# Altium schematic sheet projet LED.SchDoc
size A2
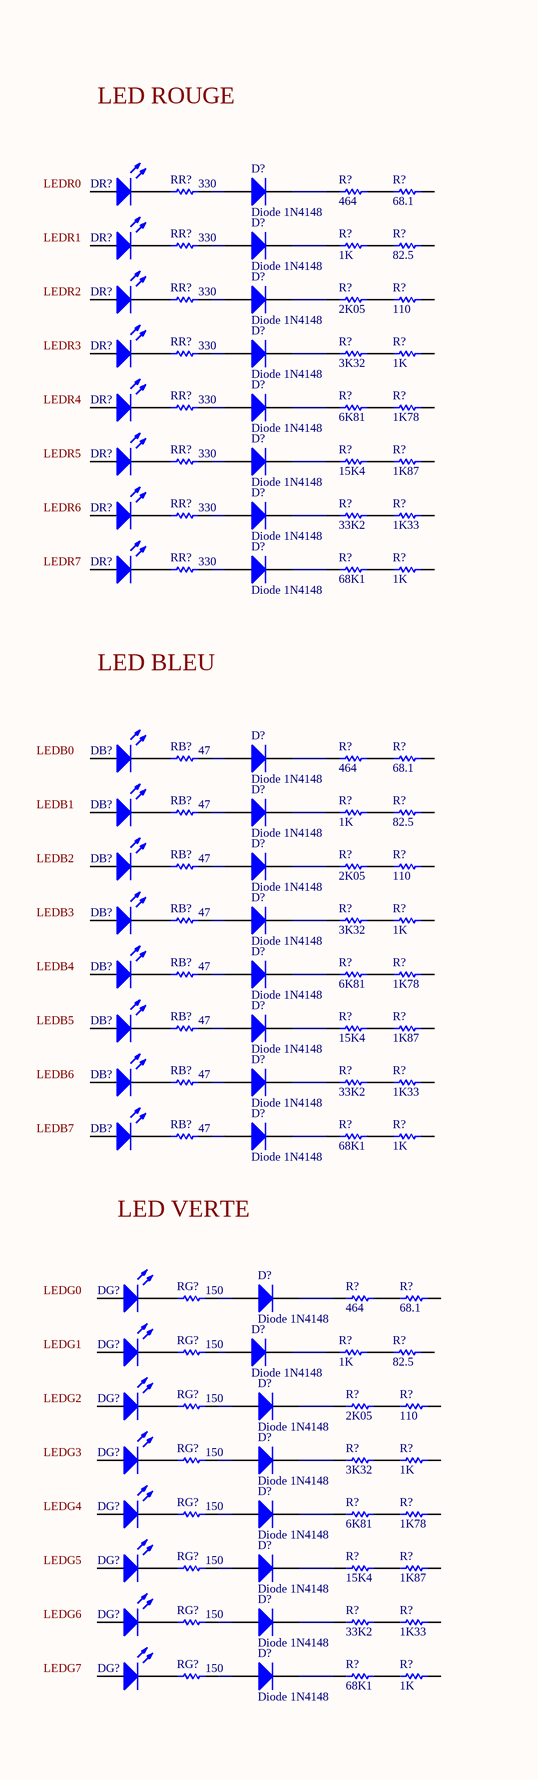
[diagram p0: projet LED.SchDoc, left]
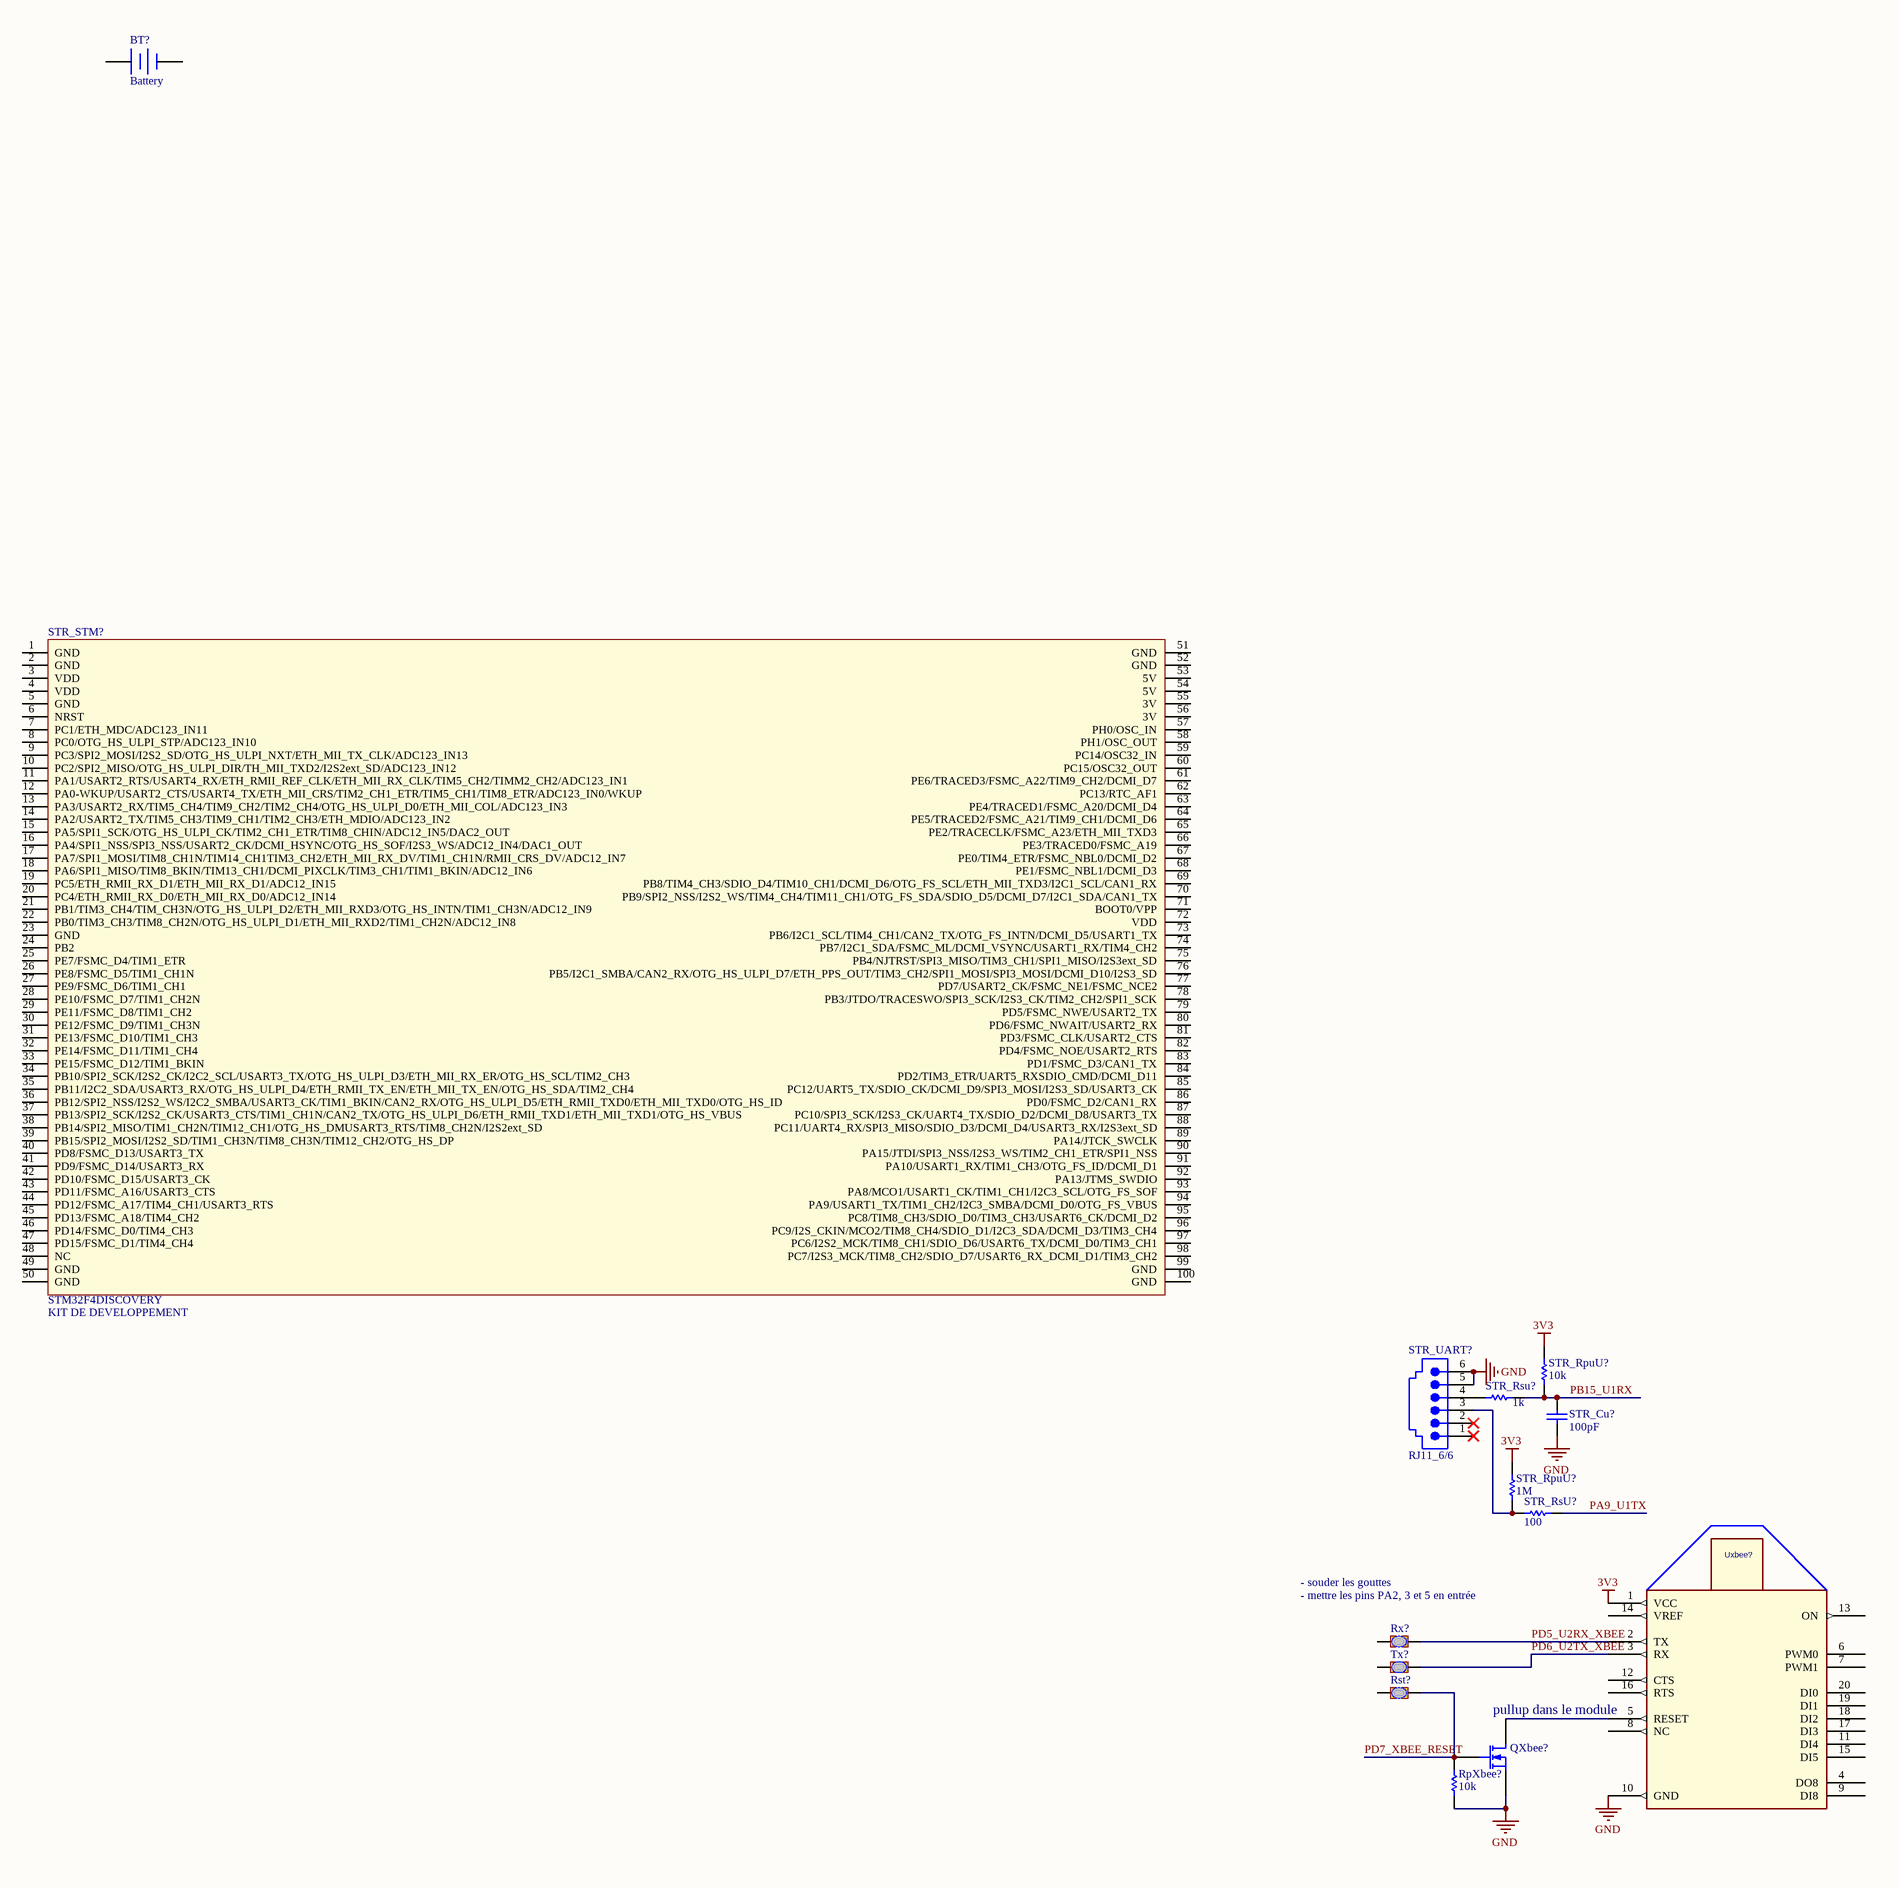
[diagram p1: projet LED.SchDoc, right]

## Parts
(Parts that share a designator on the sheet are numbered #1, #2 ... from top to bottom, then left to right.)
BT?  Battery  [BAT-2]
D?#1  Diode 1N4148  [DO-35]
D?#2  Diode 1N4148  [DO-35]
D?#3  Diode 1N4148  [DO-35]
D?#4  Diode 1N4148  [DO-35]
D?#5  Diode 1N4148  [DO-35]
D?#6  Diode 1N4148  [DO-35]
D?#7  Diode 1N4148  [DO-35]
D?#8  Diode 1N4148  [DO-35]
D?#9  Diode 1N4148  [DO-35]
D?#10  Diode 1N4148  [DO-35]
D?#11  Diode 1N4148  [DO-35]
D?#12  Diode 1N4148  [DO-35]
D?#13  Diode 1N4148  [DO-35]
D?#14  Diode 1N4148  [DO-35]
D?#15  Diode 1N4148  [DO-35]
D?#16  Diode 1N4148  [DO-35]
D?#17  Diode 1N4148  [DO-35]
D?#18  Diode 1N4148  [DO-35]
D?#19  Diode 1N4148  [DO-35]
D?#20  Diode 1N4148  [DO-35]
D?#21  Diode 1N4148  [DO-35]
D?#22  Diode 1N4148  [DO-35]
D?#23  Diode 1N4148  [DO-35]
D?#24  Diode 1N4148  [DO-35]
DB?#1  LED  [LED_sideView_1204]  (value not drawn)
DB?#2  LED  [LED_sideView_1204]  (value not drawn)
DB?#3  LED  [LED_sideView_1204]  (value not drawn)
DB?#4  LED  [LED_sideView_1204]  (value not drawn)
DB?#5  LED  [LED_sideView_1204]  (value not drawn)
DB?#6  LED  [LED_sideView_1204]  (value not drawn)
DB?#7  LED  [LED_sideView_1204]  (value not drawn)
DB?#8  LED  [LED_sideView_1204]  (value not drawn)
DG?#1  LED  [LED_sideView_1204]  (value not drawn)
DG?#2  LED  [LED_sideView_1204]  (value not drawn)
DG?#3  LED  [LED_sideView_1204]  (value not drawn)
DG?#4  LED  [LED_sideView_1204]  (value not drawn)
DG?#5  LED  [LED_sideView_1204]  (value not drawn)
DG?#6  LED  [LED_sideView_1204]  (value not drawn)
DG?#7  LED  [LED_sideView_1204]  (value not drawn)
DG?#8  LED  [LED_sideView_1204]  (value not drawn)
DR?#1  LED  [LED_sideView_1204]  (value not drawn)
DR?#2  LED  [LED_sideView_1204]  (value not drawn)
DR?#3  LED  [LED_sideView_1204]  (value not drawn)
DR?#4  LED  [LED_sideView_1204]  (value not drawn)
DR?#5  LED  [LED_sideView_1204]  (value not drawn)
DR?#6  LED  [LED_sideView_1204]  (value not drawn)
DR?#7  LED  [LED_sideView_1204]  (value not drawn)
DR?#8  LED  [LED_sideView_1204]  (value not drawn)
QXbee?  Transistor MOSFET-N  [SOT23-3N]  (value not drawn)
R?#1  464  [R0805_N]
R?#2  68.1  [R0805_N]
R?#3  1K  [R0805_N]
R?#4  82.5  [R0805_N]
R?#5  2K05  [R0805_N]
R?#6  110  [R0805_N]
R?#7  3K32  [R0805_N]
R?#8  1K  [R0805_N]
R?#9  6K81  [R0805_N]
R?#10  1K78  [R0805_N]
R?#11  15K4  [R0805_N]
R?#12  1K87  [R0805_N]
R?#13  33K2  [R0805_N]
R?#14  1K33  [R0805_N]
R?#15  68K1  [R0805_N]
R?#16  1K  [R0805_N]
R?#17  464  [R0805_N]
R?#18  68.1  [R0805_N]
R?#19  1K  [R0805_N]
R?#20  82.5  [R0805_N]
R?#21  2K05  [R0805_N]
R?#22  110  [R0805_N]
R?#23  3K32  [R0805_N]
R?#24  1K  [R0805_N]
R?#25  6K81  [R0805_N]
R?#26  1K78  [R0805_N]
R?#27  15K4  [R0805_N]
R?#28  1K87  [R0805_N]
R?#29  33K2  [R0805_N]
R?#30  1K33  [R0805_N]
R?#31  68K1  [R0805_N]
R?#32  1K  [R0805_N]
R?#33  464  [R0805_N]
R?#34  68.1  [R0805_N]
R?#35  1K  [R0805_N]
R?#36  82.5  [R0805_N]
R?#37  2K05  [R0805_N]
R?#38  110  [R0805_N]
R?#39  3K32  [R0805_N]
R?#40  1K  [R0805_N]
R?#41  6K81  [R0805_N]
R?#42  1K78  [R0805_N]
R?#43  15K4  [R0805_N]
R?#44  1K87  [R0805_N]
R?#45  33K2  [R0805_N]
R?#46  1K33  [R0805_N]
R?#47  68K1  [R0805_N]
R?#48  1K  [R0805_N]
RB?#1  47  [R1206_N]
RB?#2  47  [R1206_N]
RB?#3  47  [R1206_N]
RB?#4  47  [R1206_N]
RB?#5  47  [R1206_N]
RB?#6  47  [R1206_N]
RB?#7  47  [R1206_N]
RB?#8  47  [R1206_N]
RG?#1  150  [R1206_N]
RG?#2  150  [R1206_N]
RG?#3  150  [R1206_N]
RG?#4  150  [R1206_N]
RG?#5  150  [R1206_N]
RG?#6  150  [R1206_N]
RG?#7  150  [R1206_N]
RG?#8  150  [R1206_N]
RpXbee?  10k  [R1206_N]
RR?#1  330  [R1206_N]
RR?#2  330  [R1206_N]
RR?#3  330  [R1206_N]
RR?#4  330  [R1206_N]
RR?#5  330  [R1206_N]
RR?#6  330  [R1206_N]
RR?#7  330  [R1206_N]
RR?#8  330  [R1206_N]
Rst?  Goutte Strap_2  [Goutte Strap_2 Pads_Clearance 0.254mm]  (value not drawn)
Rx?  Goutte Strap_2  [Goutte Strap_2 Pads_Clearance 0.254mm]  (value not drawn)
STR_Cu?  100pF  [C0805_N]
STR_RpuU?#1  10k  [R1206_N]
STR_RpuU?#2  1M  [R1206_N]
STR_Rsu?#1  1k  [R1206_N]
STR_RsU?#2  100  [R1206_N]
STR_STM?  STM32F4DISCOVERY  Type: KIT DE DEVELOPPEMENT  [STM32_F4DISCOVERY]
STR_UART?  RJ11_6/6  [RJ11_6/6 - Wurth Half Shielded Tab Down WR-MJ]
Tx?  Goutte Strap_2  [Goutte Strap_2 Pads_Clearance 0.254mm]  (value not drawn)
Uxbee?  XBee  [MODULE_XBEE]  (value not drawn)

## Nets
3V3: STR_RpuU?#1.2 STR_RpuU?#2.2 Uxbee?.1(VCC)
GND: QXbee?.2(S) RpXbee?.2 STR_Cu?.1 STR_UART?.5 STR_UART?.6 Uxbee?.10(GND)
PA9_U1TX: STR_RsU?#2.2
PB15_U1RX: STR_Cu?.2 STR_RpuU?#1.1 STR_Rsu?#1.1
PD5_U2RX_XBEE: Rx?.2 Uxbee?.2(TX)
PD6_U2TX_XBEE: Tx?.2 Uxbee?.3(RX)
PD7_XBEE_RESET: QXbee?.1(G) RpXbee?.1 Rst?.2
NetD?#1_1: D?#1.1(A) RR?#1.1
NetD?#1_2: D?#1.2(K) R?#1.1
NetD?#2_1: D?#2.1(A) RR?#2.1
NetD?#2_2: D?#2.2(K) R?#3.1
NetD?#3_1: D?#3.1(A) RR?#3.1
NetD?#3_2: D?#3.2(K) R?#5.1
NetD?#4_1: D?#4.1(A) RR?#4.1
NetD?#4_2: D?#4.2(K) R?#7.1
NetD?#5_1: D?#5.1(A) RR?#5.1
NetD?#5_2: D?#5.2(K) R?#9.1
NetD?#6_1: D?#6.1(A) RR?#6.1
NetD?#6_2: D?#6.2(K) R?#11.1
NetD?#7_1: D?#7.1(A) RR?#7.1
NetD?#7_2: D?#7.2(K) R?#13.1
NetD?#8_1: D?#8.1(A) RR?#8.1
NetD?#8_2: D?#8.2(K) R?#15.1
NetD?#9_1: D?#9.1(A) RB?#1.1
NetD?#9_2: D?#9.2(K) R?#17.1
NetD?#10_1: D?#10.1(A) RB?#2.1
NetD?#10_2: D?#10.2(K) R?#19.1
NetD?#11_1: D?#11.1(A) RB?#3.1
NetD?#11_2: D?#11.2(K) R?#21.1
NetD?#12_1: D?#12.1(A) RB?#4.1
NetD?#12_2: D?#12.2(K) R?#23.1
NetD?#13_1: D?#13.1(A) RB?#5.1
NetD?#13_2: D?#13.2(K) R?#25.1
NetD?#14_1: D?#14.1(A) RB?#6.1
NetD?#14_2: D?#14.2(K) R?#27.1
NetD?#15_1: D?#15.1(A) RB?#7.1
NetD?#15_2: D?#15.2(K) R?#29.1
NetD?#16_1: D?#16.1(A) RB?#8.1
NetD?#16_2: D?#16.2(K) R?#31.1
NetD?#17_1: D?#17.1(A) RG?#1.1
NetD?#17_2: D?#17.2(K) R?#33.1
NetD?#18_1: D?#18.1(A) RG?#2.1
NetD?#18_2: D?#18.2(K) R?#35.1
NetD?#19_1: D?#19.1(A) RG?#3.1
NetD?#19_2: D?#19.2(K) R?#37.1
NetD?#20_1: D?#20.1(A) RG?#4.1
NetD?#20_2: D?#20.2(K) R?#39.1
NetD?#21_1: D?#21.1(A) RG?#5.1
NetD?#21_2: D?#21.2(K) R?#41.1
NetD?#22_1: D?#22.1(A) RG?#6.1
NetD?#22_2: D?#22.2(K) R?#43.1
NetD?#23_1: D?#23.1(A) RG?#7.1
NetD?#23_2: D?#23.2(K) R?#45.1
NetD?#24_1: D?#24.1(A) RG?#8.1
NetD?#24_2: D?#24.2(K) R?#47.1
NetDB?#1_2: DB?#1.2(K) RB?#1.2
NetDB?#2_2: DB?#2.2(K) RB?#2.2
NetDB?#3_2: DB?#3.2(K) RB?#3.2
NetDB?#4_2: DB?#4.2(K) RB?#4.2
NetDB?#5_2: DB?#5.2(K) RB?#5.2
NetDB?#6_2: DB?#6.2(K) RB?#6.2
NetDB?#7_2: DB?#7.2(K) RB?#7.2
NetDB?#8_2: DB?#8.2(K) RB?#8.2
NetDG?#1_2: DG?#1.2(K) RG?#1.2
NetDG?#2_2: DG?#2.2(K) RG?#2.2
NetDG?#3_2: DG?#3.2(K) RG?#3.2
NetDG?#4_2: DG?#4.2(K) RG?#4.2
NetDG?#5_2: DG?#5.2(K) RG?#5.2
NetDG?#6_2: DG?#6.2(K) RG?#6.2
NetDG?#7_2: DG?#7.2(K) RG?#7.2
NetDG?#8_2: DG?#8.2(K) RG?#8.2
NetDR?#1_2: DR?#1.2(K) RR?#1.2
NetDR?#2_2: DR?#2.2(K) RR?#2.2
NetDR?#3_2: DR?#3.2(K) RR?#3.2
NetDR?#4_2: DR?#4.2(K) RR?#4.2
NetDR?#5_2: DR?#5.2(K) RR?#5.2
NetDR?#6_2: DR?#6.2(K) RR?#6.2
NetDR?#7_2: DR?#7.2(K) RR?#7.2
NetDR?#8_2: DR?#8.2(K) RR?#8.2
NetQXbee?_3: QXbee?.3(D) Uxbee?.5(RESET)
NetR?#1_2: R?#1.2 R?#2.1
NetR?#3_2: R?#3.2 R?#4.1
NetR?#5_2: R?#5.2 R?#6.1
NetR?#7_2: R?#7.2 R?#8.1
NetR?#9_2: R?#9.2 R?#10.1
NetR?#11_2: R?#11.2 R?#12.1
NetR?#13_2: R?#13.2 R?#14.1
NetR?#15_2: R?#15.2 R?#16.1
NetR?#17_2: R?#17.2 R?#18.1
NetR?#19_2: R?#19.2 R?#20.1
NetR?#21_2: R?#21.2 R?#22.1
NetR?#23_2: R?#23.2 R?#24.1
NetR?#25_2: R?#25.2 R?#26.1
NetR?#27_2: R?#27.2 R?#28.1
NetR?#29_2: R?#29.2 R?#30.1
NetR?#31_2: R?#31.2 R?#32.1
NetR?#33_2: R?#33.2 R?#34.1
NetR?#35_2: R?#35.2 R?#36.1
NetR?#37_2: R?#37.2 R?#38.1
NetR?#39_2: R?#39.2 R?#40.1
NetR?#41_2: R?#41.2 R?#42.1
NetR?#43_2: R?#43.2 R?#44.1
NetR?#45_2: R?#45.2 R?#46.1
NetR?#47_2: R?#47.2 R?#48.1
NetSTR_RpuU?#2_1: STR_RpuU?#2.1 STR_RsU?#2.1 STR_UART?.3
NetSTR_Rsu?#1_2: STR_Rsu?#1.2 STR_UART?.4

Not connected (* = marked no-connect by the designer): BT? 1(+) 2(-); DB?#1 1(A); DB?#2 1(A); DB?#3 1(A); DB?#4 1(A); DB?#5 1(A); DB?#6 1(A); DB?#7 1(A); DB?#8 1(A); DG?#1 1(A); DG?#2 1(A); DG?#3 1(A); DG?#4 1(A); DG?#5 1(A); DG?#6 1(A); DG?#7 1(A); DG?#8 1(A); DR?#1 1(A); DR?#2 1(A); DR?#3 1(A); DR?#4 1(A); DR?#5 1(A); DR?#6 1(A); DR?#7 1(A); DR?#8 1(A); R?#2 2; R?#4 2; R?#6 2; R?#8 2; R?#10 2; R?#12 2; R?#14 2; R?#16 2; R?#18 2; R?#20 2; R?#22 2; R?#24 2; R?#26 2; R?#28 2; R?#30 2; R?#32 2; R?#34 2; R?#36 2; R?#38 2; R?#40 2; R?#42 2; R?#44 2; R?#46 2; R?#48 2; Rst? 1; Rx? 1; STR_STM? 1(GND) 2(GND) 3(VDD) 4(VDD) 5(GND) 6(NRST) 7(PC1/ETH_MDC/ADC123_IN11) 8(PC0/OTG_HS_ULPI_STP/ADC123_IN10) 9(PC3/SPI2_MOSI/I2S2_SD/OTG_HS_ULPI_NXT/ETH_MII_TX_CLK/ADC123_IN13) 10(PC2/SPI2_MISO/OTG_HS_ULPI_DIR/TH_MII_TXD2/I2S2ext_SD/ADC123_IN12) 11(PA1/USART2_RTS/USART4_RX/ETH_RMII_REF_CLK/ETH_MII_RX_CLK/TIM5_CH2/TIMM2_CH2/ADC123_IN1) 12(PA0-WKUP/USART2_CTS/USART4_TX/ETH_MII_CRS/TIM2_CH1_ETR/TIM5_CH1/TIM8_ETR/ADC123_IN0/WKUP) 13(PA3/USART2_RX/TIM5_CH4/TIM9_CH2/TIM2_CH4/OTG_HS_ULPI_D0/ETH_MII_COL/ADC123_IN3) 14(PA2/USART2_TX/TIM5_CH3/TIM9_CH1/TIM2_CH3/ETH_MDIO/ADC123_IN2) 15(PA5/SPI1_SCK/OTG_HS_ULPI_CK/TIM2_CH1_ETR/TIM8_CHIN/ADC12_IN5/DAC2_OUT) 16(PA4/SPI1_NSS/SPI3_NSS/USART2_CK/DCMI_HSYNC/OTG_HS_SOF/I2S3_WS/ADC12_IN4/DAC1_OUT) 17(PA7/SPI1_MOSI/TIM8_CH1N/TIM14_CH1TIM3_CH2/ETH_MII_RX_DV/TIM1_CH1N/RMII_CRS_DV/ADC12_IN7) 18(PA6/SPI1_MISO/TIM8_BKIN/TIM13_CH1/DCMI_PIXCLK/TIM3_CH1/TIM1_BKIN/ADC12_IN6) 19(PC5/ETH_RMII_RX_D1/ETH_MII_RX_D1/ADC12_IN15) 20(PC4/ETH_RMII_RX_D0/ETH_MII_RX_D0/ADC12_IN14) 21(PB1/TIM3_CH4/TIM_CH3N/OTG_HS_ULPI_D2/ETH_MII_RXD3/OTG_HS_INTN/TIM1_CH3N/ADC12_IN9) 22(PB0/TIM3_CH3/TIM8_CH2N/OTG_HS_ULPI_D1/ETH_MII_RXD2/TIM1_CH2N/ADC12_IN8) 23(GND) 24(PB2) 25(PE7/FSMC_D4/TIM1_ETR) 26(PE8/FSMC_D5/TIM1_CH1N) 27(PE9/FSMC_D6/TIM1_CH1) 28(PE10/FSMC_D7/TIM1_CH2N) 29(PE11/FSMC_D8/TIM1_CH2) 30(PE12/FSMC_D9/TIM1_CH3N) 31(PE13/FSMC_D10/TIM1_CH3) 32(PE14/FSMC_D11/TIM1_CH4) 33(PE15/FSMC_D12/TIM1_BKIN) 34(PB10/SPI2_SCK/I2S2_CK/I2C2_SCL/USART3_TX/OTG_HS_ULPI_D3/ETH_MII_RX_ER/OTG_HS_SCL/TIM2_CH3) 35(PB11/I2C2_SDA/USART3_RX/OTG_HS_ULPI_D4/ETH_RMII_TX_EN/ETH_MII_TX_EN/OTG_HS_SDA/TIM2_CH4) 36(PB12/SPI2_NSS/I2S2_WS/I2C2_SMBA/USART3_CK/TIM1_BKIN/CAN2_RX/OTG_HS_ULPI_D5/ETH_RMII_TXD0/ETH_MII_TXD0/OTG_HS_ID) 37(PB13/SPI2_SCK/I2S2_CK/USART3_CTS/TIM1_CH1N/CAN2_TX/OTG_HS_ULPI_D6/ETH_RMII_TXD1/ETH_MII_TXD1/OTG_HS_VBUS) 38(PB14/SPI2_MISO/TIM1_CH2N/TIM12_CH1/OTG_HS_DMUSART3_RTS/TIM8_CH2N/I2S2ext_SD) 39(PB15/SPI2_MOSI/I2S2_SD/TIM1_CH3N/TIM8_CH3N/TIM12_CH2/OTG_HS_DP) 40(PD8/FSMC_D13/USART3_TX) 41(PD9/FSMC_D14/USART3_RX) 42(PD10/FSMC_D15/USART3_CK) 43(PD11/FSMC_A16/USART3_CTS) 44(PD12/FSMC_A17/TIM4_CH1/USART3_RTS) 45(PD13/FSMC_A18/TIM4_CH2) 46(PD14/FSMC_D0/TIM4_CH3) 47(PD15/FSMC_D1/TIM4_CH4) 48(NC) 49(GND) 50(GND) 51(GND) 52(GND) 53(5V) 54(5V) 55(3V) 56(3V) 57(PH0/OSC_IN) 58(PH1/OSC_OUT) 59(PC14/OSC32_IN) 60(PC15/OSC32_OUT) 61(PE6/TRACED3/FSMC_A22/TIM9_CH2/DCMI_D7) 62(PC13/RTC_AF1) 63(PE4/TRACED1/FSMC_A20/DCMI_D4) 64(PE5/TRACED2/FSMC_A21/TIM9_CH1/DCMI_D6) 65(PE2/TRACECLK/FSMC_A23/ETH_MII_TXD3) 66(PE3/TRACED0/FSMC_A19) 67(PE0/TIM4_ETR/FSMC_NBL0/DCMI_D2) 68(PE1/FSMC_NBL1/DCMI_D3) 69(PB8/TIM4_CH3/SDIO_D4/TIM10_CH1/DCMI_D6/OTG_FS_SCL/ETH_MII_TXD3/I2C1_SCL/CAN1_RX) 70(PB9/SPI2_NSS/I2S2_WS/TIM4_CH4/TIM11_CH1/OTG_FS_SDA/SDIO_D5/DCMI_D7/I2C1_SDA/CAN1_TX) 71(BOOT0/VPP) 72(VDD) 73(PB6/I2C1_SCL/TIM4_CH1/CAN2_TX/OTG_FS_INTN/DCMI_D5/USART1_TX) 74(PB7/I2C1_SDA/FSMC_ML/DCMI_VSYNC/USART1_RX/TIM4_CH2) 75(PB4/NJTRST/SPI3_MISO/TIM3_CH1/SPI1_MISO/I2S3ext_SD) 76(PB5/I2C1_SMBA/CAN2_RX/OTG_HS_ULPI_D7/ETH_PPS_OUT/TIM3_CH2/SPI1_MOSI/SPI3_MOSI/DCMI_D10/I2S3_SD) 77(PD7/USART2_CK/FSMC_NE1/FSMC_NCE2) 78(PB3/JTDO/TRACESWO/SPI3_SCK/I2S3_CK/TIM2_CH2/SPI1_SCK) 79(PD5/FSMC_NWE/USART2_TX) 80(PD6/FSMC_NWAIT/USART2_RX) 81(PD3/FSMC_CLK/USART2_CTS) 82(PD4/FSMC_NOE/USART2_RTS) 83(PD1/FSMC_D3/CAN1_TX) 84(PD2/TIM3_ETR/UART5_RXSDIO_CMD/DCMI_D11) 85(PC12/UART5_TX/SDIO_CK/DCMI_D9/SPI3_MOSI/I2S3_SD/USART3_CK) 86(PD0/FSMC_D2/CAN1_RX) 87(PC10/SPI3_SCK/I2S3_CK/UART4_TX/SDIO_D2/DCMI_D8/USART3_TX) 88(PC11/UART4_RX/SPI3_MISO/SDIO_D3/DCMI_D4/USART3_RX/I2S3ext_SD) 89(PA14/JTCK_SWCLK) 90(PA15/JTDI/SPI3_NSS/I2S3_WS/TIM2_CH1_ETR/SPI1_NSS) 91(PA10/USART1_RX/TIM1_CH3/OTG_FS_ID/DCMI_D1) 92(PA13/JTMS_SWDIO) 93(PA8/MCO1/USART1_CK/TIM1_CH1/I2C3_SCL/OTG_FS_SOF) 94(PA9/USART1_TX/TIM1_CH2/I2C3_SMBA/DCMI_D0/OTG_FS_VBUS) 95(PC8/TIM8_CH3/SDIO_D0/TIM3_CH3/USART6_CK/DCMI_D2) 96(PC9/I2S_CKIN/MCO2/TIM8_CH4/SDIO_D1/I2C3_SDA/DCMI_D3/TIM3_CH4) 97(PC6/I2S2_MCK/TIM8_CH1/SDIO_D6/USART6_TX/DCMI_D0/TIM3_CH1) 98(PC7/I2S3_MCK/TIM8_CH2/SDIO_D7/USART6_RX_DCMI_D1/TIM3_CH2) 99(GND) 100(GND); STR_UART? 1* 2*; Tx? 1; Uxbee? 4(DO8) 6(PWM0) 7(PWM1) 8(NC) 9(DI8) 11(DI4) 12(CTS) 13(ON) 14(VREF) 15(DI5) 16(RTS) 17(DI3) 18(DI2) 19(DI1) 20(DI0)

## Notes on the sheet
- - souder les gouttes
- (near Rx?) - mettre les pins PA2, 3 et 5 en entrée
- (near Uxbee?) pullup dans le module
- Labels drawn without touching a wire or pin: LED BLEU, LED ROUGE, LED VERTE, LEDB0, LEDB1, LEDB2, LEDB3, LEDB4, LEDB5, LEDB6, LEDB7, LEDG0, LEDG1, LEDG2, LEDG3, LEDG4, LEDG5, LEDG6, LEDG7, LEDR0, LEDR1, LEDR2, LEDR3, LEDR4, LEDR5, LEDR6, LEDR7

## Library data of the parts
BT? = Battery: Multicell Battery; Published: 24-Mar-1999; LatestRevisionDate: 17-Jul-2002; LatestRevisionNote: Re-released for DXP Platform.; PackageReference: BAT-2; Publisher: Altium Limited; PackageDescription: Battery; 2 Leads
D?#1-D?#24 = Diode 1N4148: High Conductance Fast Diode; Published: 8-Jun-2000; LatestRevisionDate: 17-Jul-2002; LatestRevisionNote: Re-released for DXP Platform.; DatasheetVersion: 1997; PackageReference: DO-35; Publisher: Altium Limited; PackageDescription: Diode, Axial; Body 3.8 x 1.9 mm (LxDia. max), Lead Dia. 0.53 mm (max); Code_JEDEC: DO-204-AH; ComponentLink1Description: Manufacturer Link; ComponentLink1URL: http://www.fairchildsemi.com/; ComponentLink2Description: Datasheet; ComponentLink2URL: http://www.fairchildsemi.com/ds/1N%2F1N4148.pdf
DB?#1-DB?#8 DG?#1-DG?#8 DR?#1-DR?#8 = LED: Typical LED; Published: 8-Jun-2000; LatestRevisionDate: 08-Jul-2005; LatestRevisionNote: Mech Layer 1 removed.; PackageReference: LED-1; Publisher: Altium Limited
QXbee? = Transistor MOSFET-N: N-Channel MOSFET; PackageDocument: 1995/1996; Published: 8-Jun-2000; LatestRevisionDate: 17-Jul-2002; LatestRevisionNote: Re-released for DXP Platform.; PackageReference: E3; Publisher: Altium Limited
R?#1-R?#48 RB?#1-RB?#8 RG?#1-RG?#8 RpXbee? RR?#1-RR?#8 STR_RpuU?#1 STR_RpuU?#2 STR_Rsu?#1 STR_RsU?#2 = Resistor: Published: 8-Jun-2000; LatestRevisionDate: 17-Jul-2002; LatestRevisionNote: Re-released for DXP Platform.; PackageReference: AXIAL-0.5; Publisher: Altium Limited
STR_Cu? = Condensateur: Capacitor; Published: 8-Jun-2000; LatestRevisionDate: 17-Jul-2002; LatestRevisionNote: Re-released for DXP Platform.; PackageReference: RAD-0.3; Publisher: Altium Limited
STR_STM? = STM32F4DISCOVERY: KIT DE DEVELOPPEMENT POUR MICROCONTROLEUR STM32F407VGT6
STR_UART? = RJ11_6/6: Right Angle, Standard Profile, Offset Latch DECconnect, Flangeless PCB Jack; Ports: 1; Positions/Loaded: Port1 - 6 Offset Latch/6; PerformanceCategory: 3; PCB_Mounting: Thru-Hole; DrillSize: Nominal, Rounded to nearest 0.05mm; PCB_Layout: Complies with Manufacturer's Recommendation.; Published: 25-Jun-2002; DatasheetDocument: 18-Dec-2001; PackageDocument: 18-Dec-2001; PackageReference: 15-43-6110; Publisher: Altium Limited; ComponentLink1Description: Manufacturer Link; ComponentLink1URL: http://www.molex.com/; ComponentLink2Description: Datasheet; ComponentLink2URL: http://www.molex.com/cmc_upload/common_files/1212003_41369catalogpage.pdf; Type: RJ11_6/6
Rst? Rx? Tx? = Goutte Strap_2: LatestRevisionDate: 30/01/11; Publisher: Damien Guitton